# EAGLE schematic LimaIO (EAGLE 6.1)
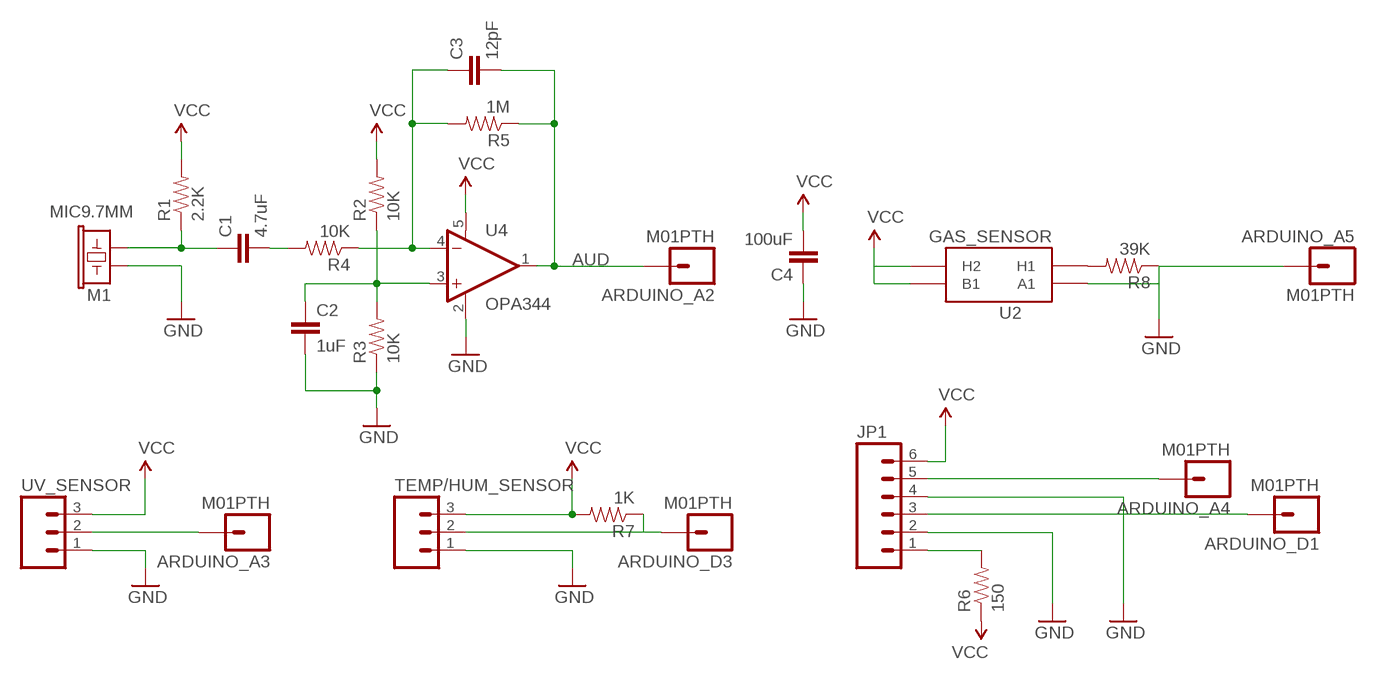
[diagram p0: schematic, sheet 1]

## Parts
ARDUINO_A2  M01PTH  [1X01]
ARDUINO_A3  M01PTH  [1X01]
ARDUINO_A4  M01PTH  [1X01]
ARDUINO_A5  M01PTH  [1X01]
ARDUINO_D1  M01PTH  [1X01]
ARDUINO_D3  M01PTH  [1X01]
C1  4.7uF  CAP0402-CAP  [0402-CAP]
C2  1uF  CAP0402-CAP  [0402-CAP]
C3  12pF  CAP0402-CAP  [0402-CAP]
C4  100uF  CAP0402-CAP  [0402-CAP]
JP1  M06LONGPADS  [1X06_LONGPADS]
M1  MIC9.7MM  [MIC-9.7MM]
R1  2.2K  RESISTOR0402-RES  [0402-RES]
R2  10K  RESISTOR0402-RES  [0402-RES]
R3  10K  RESISTOR0402-RES  [0402-RES]
R4  10K  RESISTOR0402-RES  [0402-RES]
R5  1M  RESISTOR0402-RES  [0402-RES]
R6  150  RESISTOR0402-RES  [0402-RES]
R7  1K  RESISTOR0402-RES  [0402-RES]
R8  39K  RESISTOR0402-RES  [0402-RES]
TEMP/HUM_SENSOR  M03PTH  [1X03]
U2  GAS_SENSOR  [MQ-3]
U4  OPA344  [SOT23-5]
UV_SENSOR  M03PTH  [1X03]

## Nets
AUD: ARDUINO_A2.1 C3.2 R5.1 U4.1(OUT)
GND: ARDUINO_A5.1 C2.2 C4.1 JP1.2 JP1.4 M1.2 R3.1 R8.1 TEMP/HUM_SENSOR.1 U2.A1 U4.2(V-) UV_SENSOR.1
N$1: C1.1 M1.1 R1.1
N$2: C3.1 R4.1 R5.2 U4.4(-IN)
N$3: JP1.1 R6.2
N$4: ARDUINO_A3.1 UV_SENSOR.2
N$5: ARDUINO_D3.1 R7.1 TEMP/HUM_SENSOR.2
N$6: C1.2 R4.2
N$7: C2.1 R2.1 R3.2 U4.3(+IN)
N$10: ARDUINO_A4.1 JP1.5
N$11: ARDUINO_D1.1 JP1.3
N$12: R8.2 U2.HA(H1)
VCC: C4.2 JP1.6 R1.2 R2.2 R6.1 R7.2 TEMP/HUM_SENSOR.3 U2.B1 U2.HB(H2) U4.5(V+) UV_SENSOR.3

## Library data of the parts
ARDUINO_A2-ARDUINO_A5 ARDUINO_D1 ARDUINO_D3 = SparkFun:M01: Header 1 Standard 1-pin 0.1" header. Use with straight break away headers (SKU : PRT-00116), right angle break away headers (PRT-00553), swiss pins (PRT-00743), machine pins (PRT-00117), and female headers (PRT-00115).
C1-C4 = SparkFun:CAP: Capacitor Standard 0603 ceramic capacitor, and 0.1" leaded capacitor.
JP1 = SparkFun:M06: Header 6 Standard 6-pin 0.1" header. Use with straight break away headers (SKU : PRT-00116), right angle break away headers (PRT-00553), swiss pins (PRT-00743), machine pins (PRT-00117), and female headers (PRT-00115). Molex polarized connector foot print use with SKU : PRT-08094 with associated crimp pins and housings. NOTES ON THE VARIANTS LOCK and LOCK_LONGPADS... This footprint was designed to help hold the alignment of a through-hole component (i.e. 6-pin header) while soldering it into place. You may notice that each hole has been shifted either up or down by 0.005 of an inch from it's more standard position (which is a perfectly straight line). This slight alteration caused the pins (the squares in the middle) to touch the edges of the holes. Because they are alternating, it causes a "brace" to hold the component in place. 0.005 has proven to be the perfect amount of "off-center" position when using our standard breakaway headers. Although looks a little odd when you look at the bare footprint, once you have a header in there, the alteration is very hard to notice. Also, if you push a header all the way into place, it is covered up entirely on the bottom side. This idea of altering the position of holes to aid alignment will be further integrated into the Sparkfun Library for other footprints. It can help hold any component with 3 or more connection pins.
M1 = SparkFun:MIC: Microphone Omni-directional electret microphone. 9.7mm standard diameter.
R1-R8 = SparkFun:RESISTOR: Resistor Basic schematic elements and footprints for 0603, 1206, and PTH 1/10th watt (small) resistors.
TEMP/HUM_SENSOR UV_SENSOR = SparkFun:M03: Header 3 Standard 3-pin 0.1" header. Use with straight break away headers (SKU : PRT-00116), right angle break away headers (PRT-00553), swiss pins (PRT-00743), machine pins (PRT-00117), and female headers (PRT-00115). Molex polarized connector foot print use with SKU : PRT-08232 with associated crimp pins and housings.
U2 = SparkFun:GAS_SENSOR: MQ-3 Gas Sensor. FP not tested. Part#
U4 = SparkFun:OPA344